# Altium schematic sheet FULL HIERARCHICAL SCHEMATIC.SchDoc
size B; SheetNumber: 1; SheetTotal: 7
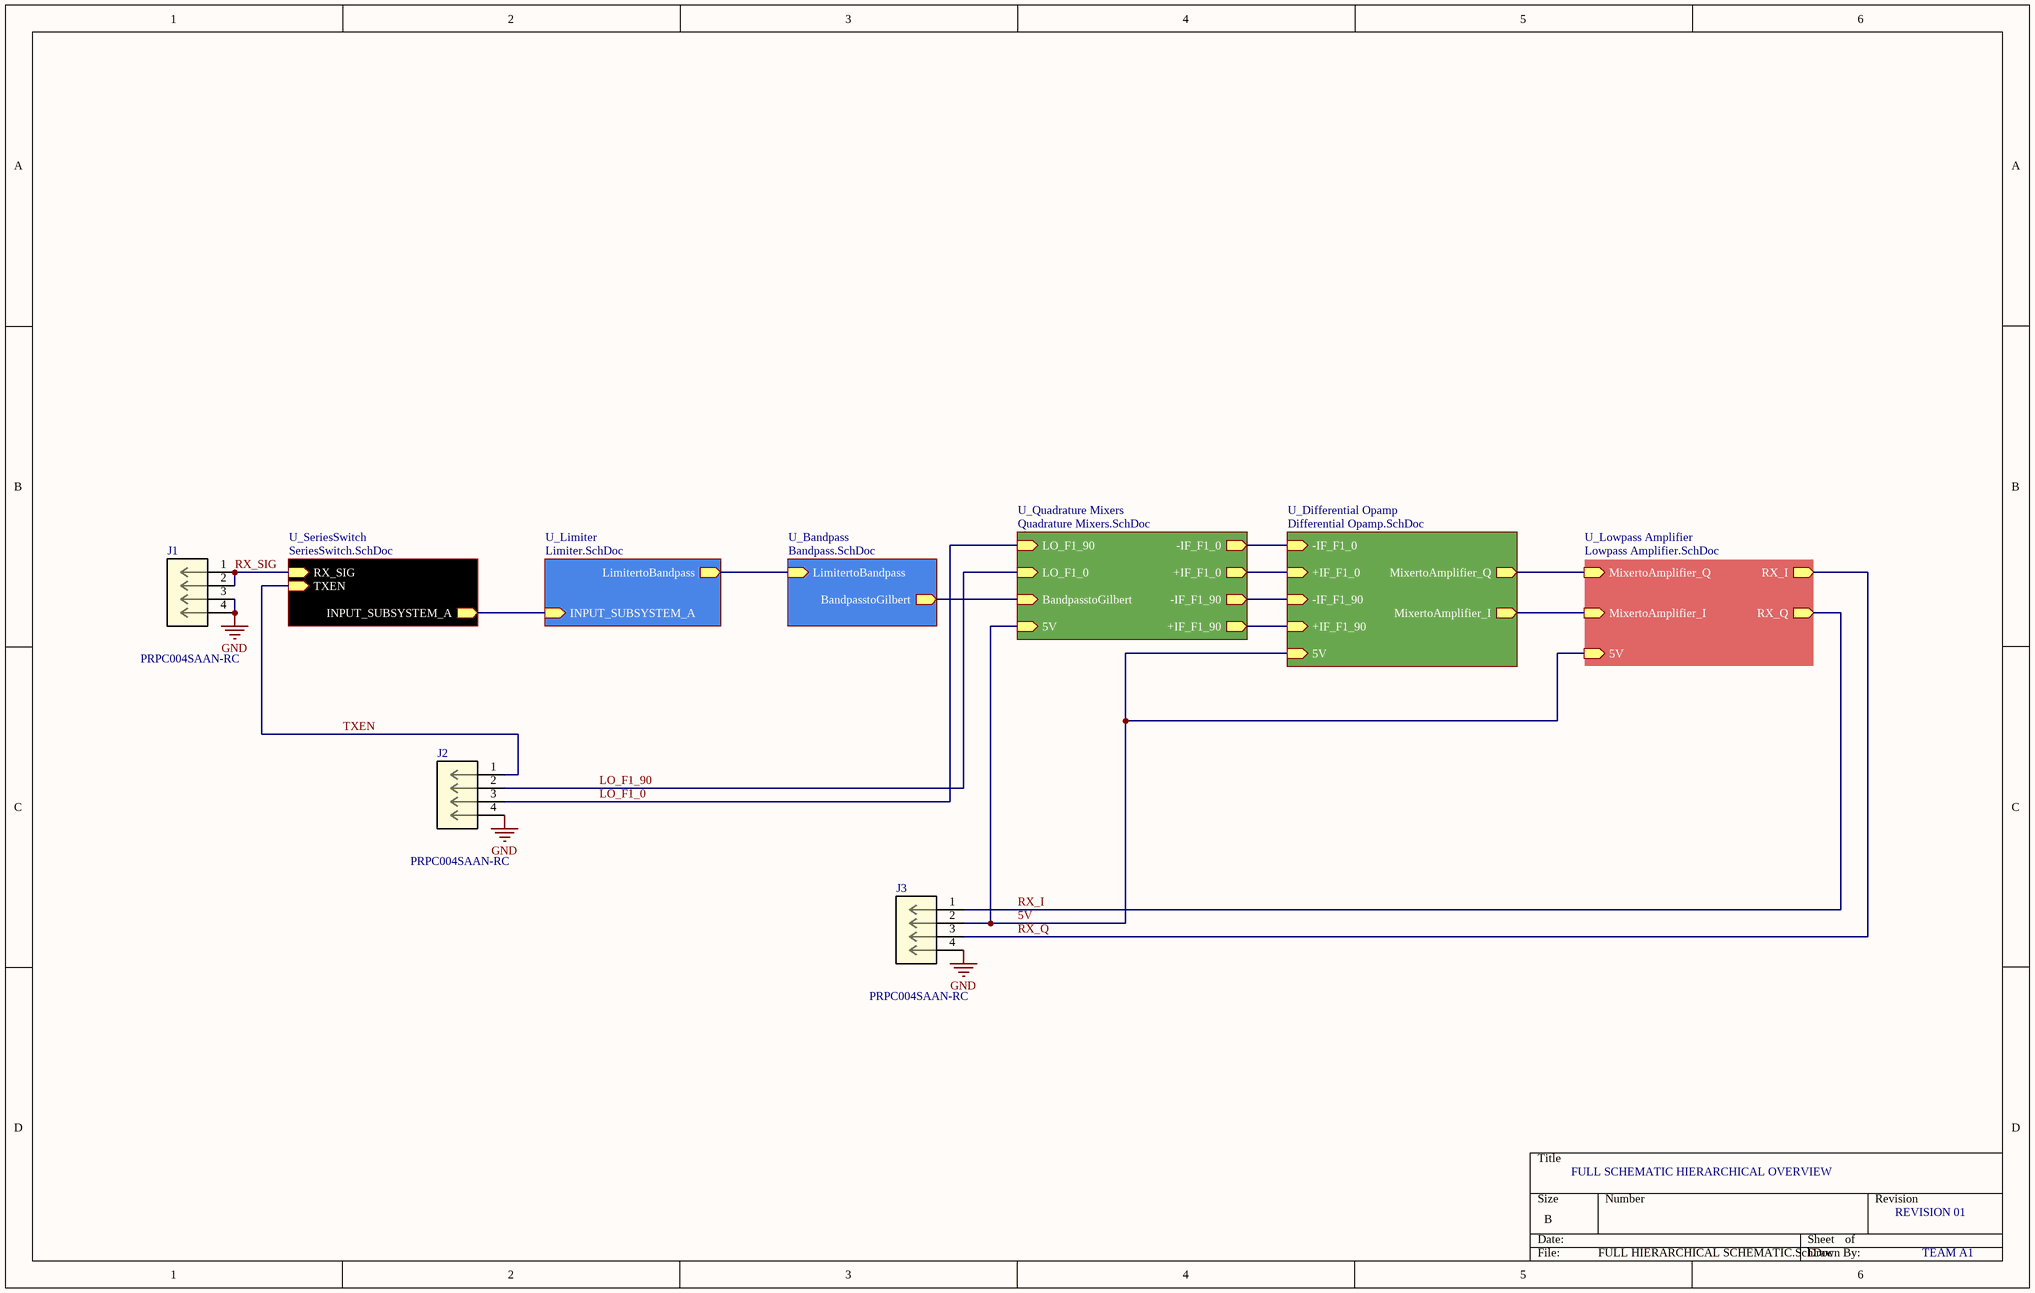
[diagram p0: FULL HIERARCHICAL SCHEMATIC.SchDoc]

## Parts
J1  PRPC004SAAN-RC  [CONN4_PRPC004_SUL]
J2  PRPC004SAAN-RC  [CONN4_PRPC004_SUL]
J3  PRPC004SAAN-RC  [CONN4_PRPC004_SUL]

## Sub-sheets
U_Bandpass = Bandpass.SchDoc: LimitertoBandpass (in), BandpasstoGilbert (out)
U_Differential Opamp = Differential Opamp.SchDoc: 5V (in), -IF_F1_90 (in), +IF_F1_90 (in), -IF_F1_0 (in), +IF_F1_0 (in), MixertoAmplifier_Q (out), MixertoAmplifier_I (out)
U_Limiter = Limiter.SchDoc: INPUT_SUBSYSTEM_A (in), LimitertoBandpass (out)
U_Lowpass Amplifier = Lowpass Amplifier.SchDoc: MixertoAmplifier_I (in), MixertoAmplifier_Q (in), RX_I (out), RX_Q (out), 5V (in)
U_Quadrature Mixers = Quadrature Mixers.SchDoc: 5V (in), LO_F1_0 (in), BandpasstoGilbert (in), LO_F1_90 (in), -IF_F1_0 (out), +IF_F1_0 (out), -IF_F1_90 (out), +IF_F1_90 (out)
U_SeriesSwitch = SeriesSwitch.SchDoc: RX_SIG (in), TXEN (in), INPUT_SUBSYSTEM_A (out)

## Nets
GND: J1.3 J1.4 J2.4 J3.4
5V: J3.2 ; sheet U_Quadrature Mixers/5V, sheet U_Differential Opamp/5V, sheet U_Lowpass Amplifier/5V
LO_F1_0: J2.3 ; sheet U_Quadrature Mixers/LO_F1_90
LO_F1_90: J2.2 ; sheet U_Quadrature Mixers/LO_F1_0
RX_I: J3.1 ; sheet U_Lowpass Amplifier/RX_Q
RX_Q: J3.3 ; sheet U_Lowpass Amplifier/RX_I
RX_SIG: J1.1 J1.2 ; sheet U_SeriesSwitch/RX_SIG
TXEN: J2.1 ; sheet U_SeriesSwitch/TXEN
(unnamed): sheet U_SeriesSwitch/INPUT_SUBSYSTEM_A, sheet U_Limiter/INPUT_SUBSYSTEM_A
(unnamed): sheet U_Limiter/LimitertoBandpass, sheet U_Bandpass/LimitertoBandpass
(unnamed): sheet U_Bandpass/BandpasstoGilbert, sheet U_Quadrature Mixers/BandpasstoGilbert
(unnamed): sheet U_Quadrature Mixers/-IF_F1_0, sheet U_Differential Opamp/-IF_F1_0
(unnamed): sheet U_Quadrature Mixers/+IF_F1_0, sheet U_Differential Opamp/+IF_F1_0
(unnamed): sheet U_Quadrature Mixers/-IF_F1_90, sheet U_Differential Opamp/-IF_F1_90
(unnamed): sheet U_Quadrature Mixers/+IF_F1_90, sheet U_Differential Opamp/+IF_F1_90
(unnamed): sheet U_Differential Opamp/MixertoAmplifier_Q, sheet U_Lowpass Amplifier/MixertoAmplifier_Q
(unnamed): sheet U_Differential Opamp/MixertoAmplifier_I, sheet U_Lowpass Amplifier/MixertoAmplifier_I

## Notes on the sheet
- FULL SCHEMATIC HIERARCHICAL OVERVIEW
- REVISION 01
- TEAM A1

## Library data of the parts
J1-J3 = PRPC004SAAN-RC: No Description Available; Mfr_Name: Sullins; Type: Headers, Male Pins; RefDes: RefDes